# Altium schematic sheet Communication.SchDoc
size A; SheetNumber: 2; SheetTotal: 4
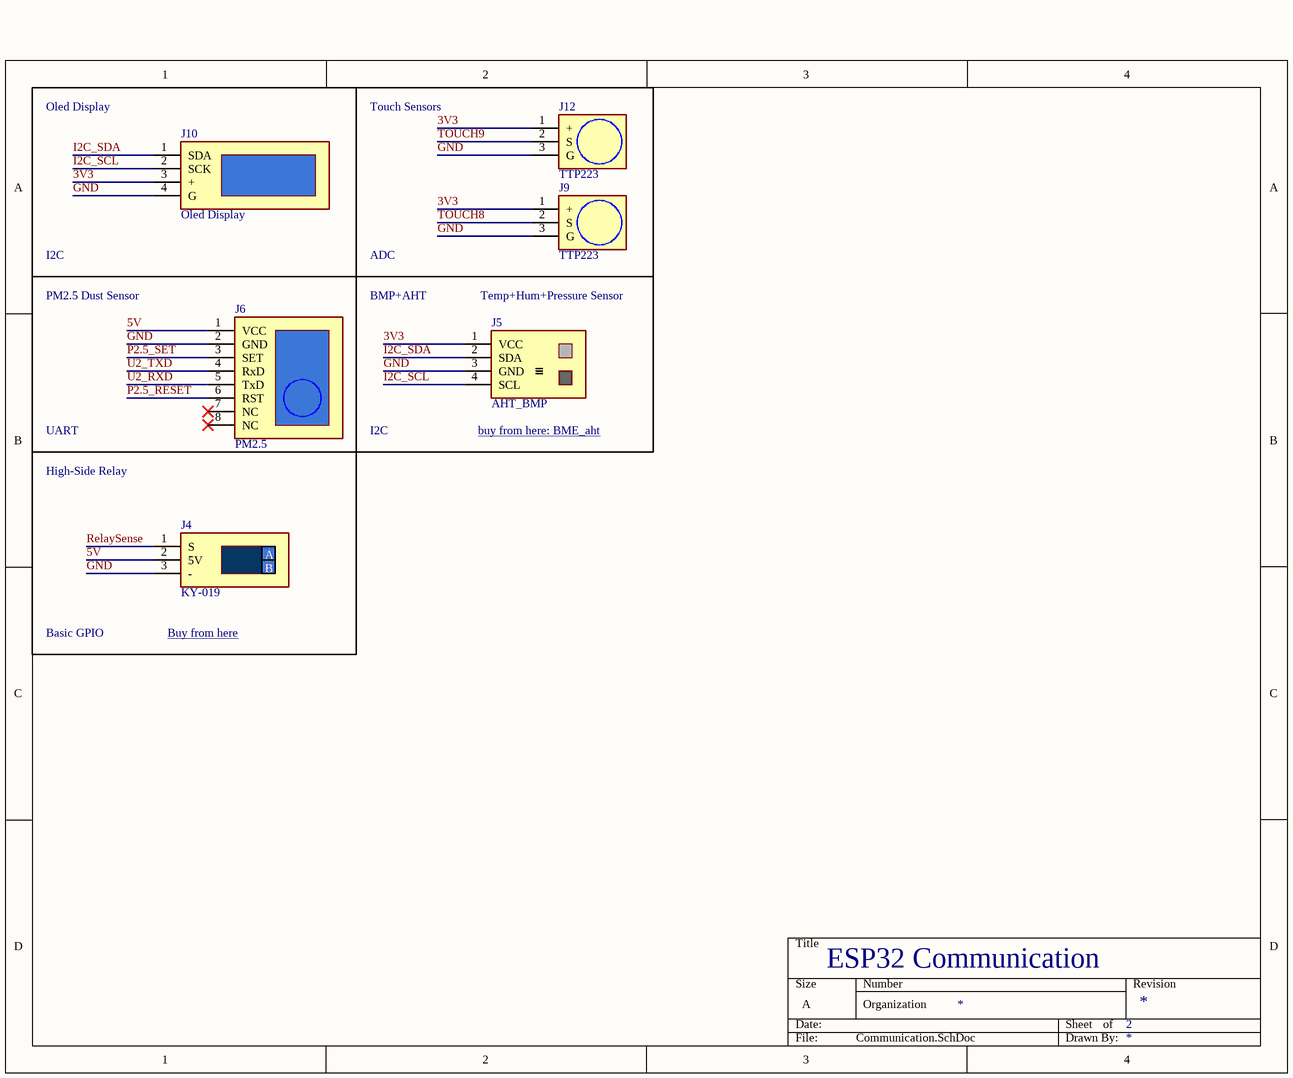
[diagram p0: Communication.SchDoc]

## Parts
J4  KY-019  [KY-019]
J5  AHT_BMP  [BMP280_AHT20]
J6  PM2.5  [PM2.5]
J9  TTP223  [TTP223_Sensor]
J10  Oled Display  [OLED_0.91_128x32]
J12  TTP223  [TTP223_Sensor]

## Nets
3V3: J5.1(VCC) J9.1(+) J10.3(+) J12.1(+)
5V: J4.2(5V) J6.1(VCC)
GND: J4.3(-) J5.3(GND) J6.2(GND) J9.3(G) J10.4(G) J12.3(G)
I2C_SCL: J5.4(SCL) J10.2(SCK)
I2C_SDA: J5.2(SDA) J10.1(SDA)
P2.5_RESET: J6.6(RST)
P2.5_SET: J6.3(SET)
RelaySense: J4.1(S)
TOUCH8: J9.2(S)
TOUCH9: J12.2(S)
U2_RXD: J6.5(TxD)
U2_TXD: J6.4(RxD)

Not connected (* = marked no-connect by the designer): J6 7(NC)* 8(NC)*

## Notes on the sheet
- Oled Display
- Touch Sensors
- I2C
- ADC
- PM2.5 Dust Sensor
- BMP+AHT                  Temp+Hum+Pressure Sensor
- High-Side Relay
- UART
- (near J5) buy from here: BME_aht <https://www.aliexpress.com/item/1005009630154976.html?spm=a2g0o.productlist.main.15.1ae4155cFHiNRk&algo_pvid=f758ec4f-2f62-40d7-a79f-4fe52f6579c2&pdp_ext_f=%7B%22order%22%3A%22133%22%2C%22eval%22%3A%221%22%2C%22fromPage%22%3A%22search%22%7D&utparam-url=scene%3Asearch%7Cquery_from%3A%7Cx_object_id%3A1005009630154976%7C_p_origin_prod%3A>
- Basic GPIO
- Buy from here <https://www.aliexpress.com/item/1005001827673469.html?spm=a2g0o.productlist.main.4.4c76a648lQAvU0&aem_p4p_detail=202605060420433784476564820970008209055&algo_pvid=ab14cfe4-ab42-4551-af76-a0fe1d7bf99c&pdp_ext_f=%7B%22order%22%3A%221415%22%2C%22eval%22%3A%221%22%2C%22fromPage%22%3A%22search%22%7D&utparam-url=scene%3Asearch%7Cquery_from%3A%7Cx_object_id%3A1005001827673469%7C_p_origin_prod%3A&search_p4p_id=202605060420433784476564820970008209055_1#nav-specification>
- ESP32 Communication
- Organization
- (in symbol KY-019) A; B

## Library data of the parts
J4 = KY-019: High-Side Relay
J5 = AHT_BMP: BMP280+AHT20. Temp+Humidity+Pressure.
J6 = PM2.5: Dust Sensor
J9 J12 = TTP223: Touch Sensor
J10 = OLED_0.91_128x32